# EAGLE design Ponte_h - Alternativa 2 (EAGLE 6.6.0)
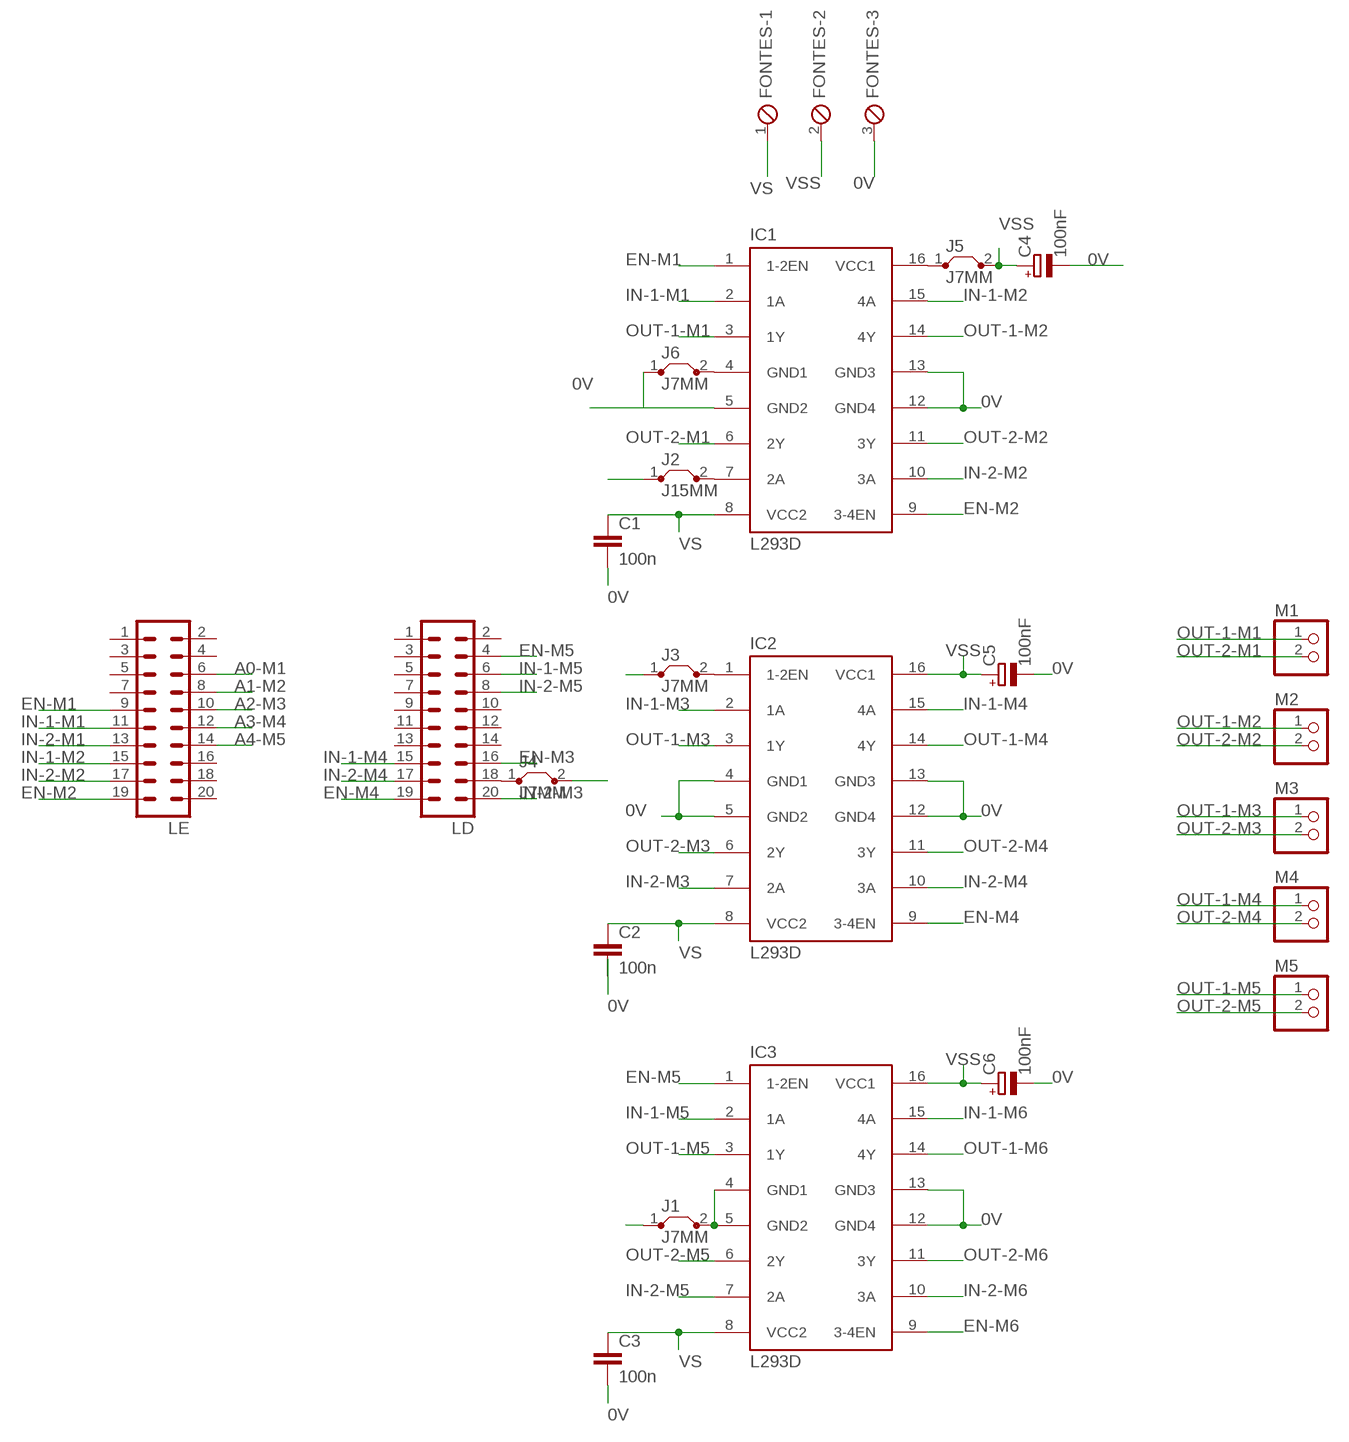
[diagram p0: schematic, sheet 1]

## Parts
C1  100n  C7.5/3  [C7.5B3]
C2  100n  C7.5/3  [C7.5B3]
C3  100n  C7.5/3  [C7.5B3]
C4  100nF  CPOL-EUE1.8-4  [E1,8-4]
C5  100nF  CPOL-EUE1.8-4  [E1,8-4]
C6  100nF  CPOL-EUE1.8-4  [E1,8-4]
FONTES  MPT3  [3POL254]
IC1  L293D  [DIL16]
IC2  L293D  [DIL16]
IC3  L293D  [DIL16]
J1  J7MM  [07]
J2  J15MM  [15]
J3  J7MM  [07]
J4  J7MM  [07]
J5  J7MM  [07]
J6  J7MM  [07]
LD  MA10-2  [MA10-2]
LE  MA10-2  [MA10-2]
M1  PINHD-1X2  [1X02]
M2  PINHD-1X2  [1X02]
M3  PINHD-1X2  [1X02]
M4  PINHD-1X2  [1X02]
M5  PINHD-1X2  [1X02]

## Nets
0V: C1.2 C2.2 C3.2 C4.- C5.- C6.- FONTES.3 IC1.5(GND2) IC1.12(GND4) IC1.13(GND3) IC2.4(GND1) IC2.5(GND2) IC2.12(GND4) IC2.13(GND3) IC3.12(GND4) IC3.13(GND3) J1.1 J6.1
A0-M1: LE.6
A1-M2: LE.8
A2-M3: LE.10
A3-M4: LE.12
A4-M5: LE.14
EN-M1: IC1.1(1-2EN) LE.9
EN-M2: IC1.9(3-4EN) LE.19
EN-M3: J3.1 J4.2 LD.16
EN-M4: IC2.9(3-4EN) LD.19
EN-M5: IC3.1(1-2EN) LD.4
EN-M6: IC3.9(3-4EN)
IN-1-M1: IC1.2(1A) LE.11
IN-1-M2: IC1.15(4A) LE.15
IN-1-M3: IC2.2(1A)
IN-1-M4: IC2.15(4A) LD.15
IN-1-M5: IC3.2(1A) LD.6
IN-1-M6: IC3.15(4A)
IN-2-M1: J2.1 LE.13
IN-2-M2: IC1.10(3A) LE.17
IN-2-M3: IC2.7(2A) LD.20
IN-2-M4: IC2.10(3A) LD.17
IN-2-M5: IC3.7(2A) LD.8
IN-2-M6: IC3.10(3A)
N$1: IC1.7(2A) J2.2
N$2: IC3.4(GND1) IC3.5(GND2) J1.2
N$3: IC2.1(1-2EN) J3.2
N$4: J4.1 LD.18
N$5: IC1.16(VCC1) J5.1
N$6: IC1.4(GND1) J6.2
OUT-1-M1: IC1.3(1Y) M1.1
OUT-1-M2: IC1.14(4Y) M2.1
OUT-1-M3: IC2.3(1Y) M3.1
OUT-1-M4: IC2.14(4Y) M4.1
OUT-1-M5: IC3.3(1Y) M5.1
OUT-1-M6: IC3.14(4Y)
OUT-2-M1: IC1.6(2Y) M1.2
OUT-2-M2: IC1.11(3Y) M2.2
OUT-2-M3: IC2.6(2Y) M3.2
OUT-2-M4: IC2.11(3Y) M4.2
OUT-2-M5: IC3.6(2Y) M5.2
OUT-2-M6: IC3.11(3Y)
VS: C1.1 C2.1 C3.1 FONTES.1 IC1.8(VCC2) IC2.8(VCC2) IC3.8(VCC2)
VSS: C4.+ C5.+ C6.+ FONTES.2 IC2.16(VCC1) IC3.16(VCC1) J5.2
Unconnected: LD.1 LD.2 LD.3 LD.5 LD.7 LD.9 LD.10 LD.11 LD.12 LD.13 LD.14 LE.1 LE.2 LE.3 LE.4 LE.5 LE.7 LE.16 LE.18 LE.20

## Library data of the parts
C1-C3 = capacitor-wima:C: CAPACITOR naming: grid - package width
C4-C6 = rcl:CPOL-EU: POLARIZED CAPACITOR, European symbol
FONTES = con-phoenix-254:MPT3: PHOENIX CONNECTOR; OC_FARNELL: unknown; OC_NEWARK: unknown
IC1-IC3 = st-microelectronics:L293D: PUSH-PULL 4 CHANNEL DRIVER; MPN: L293D; OC_FARNELL: 9589619; OC_NEWARK: 56P8249
J1-J6 = jumper:J: Bridge
LD LE = con-lstb:MA10-2: PIN HEADER; OC_FARNELL: unknown; OC_NEWARK: unknown
M1-M5 = pinhead:PINHD-1X2: PIN HEADER

## Board
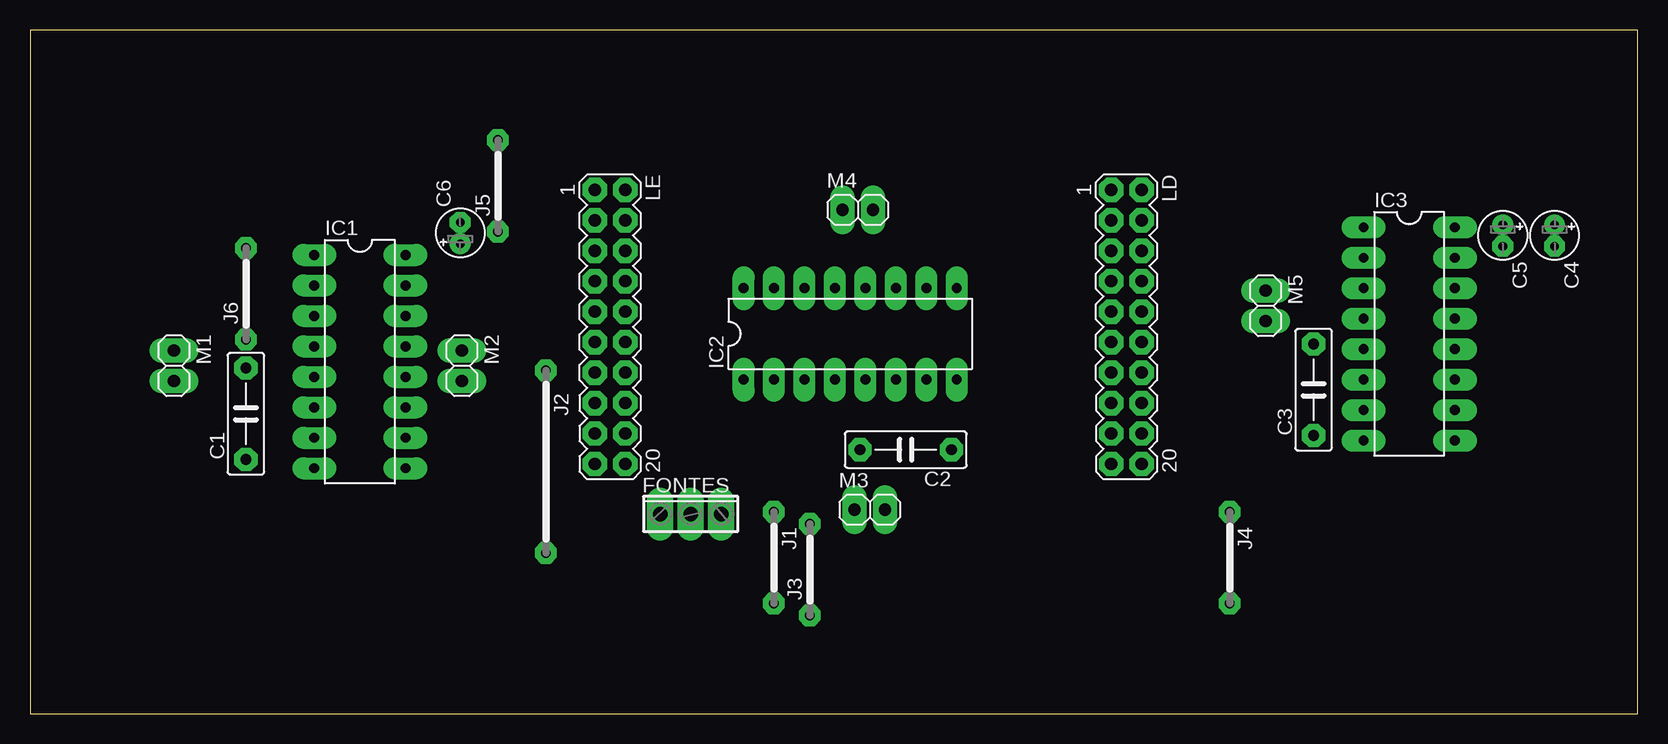
[diagram p1: board, top side]
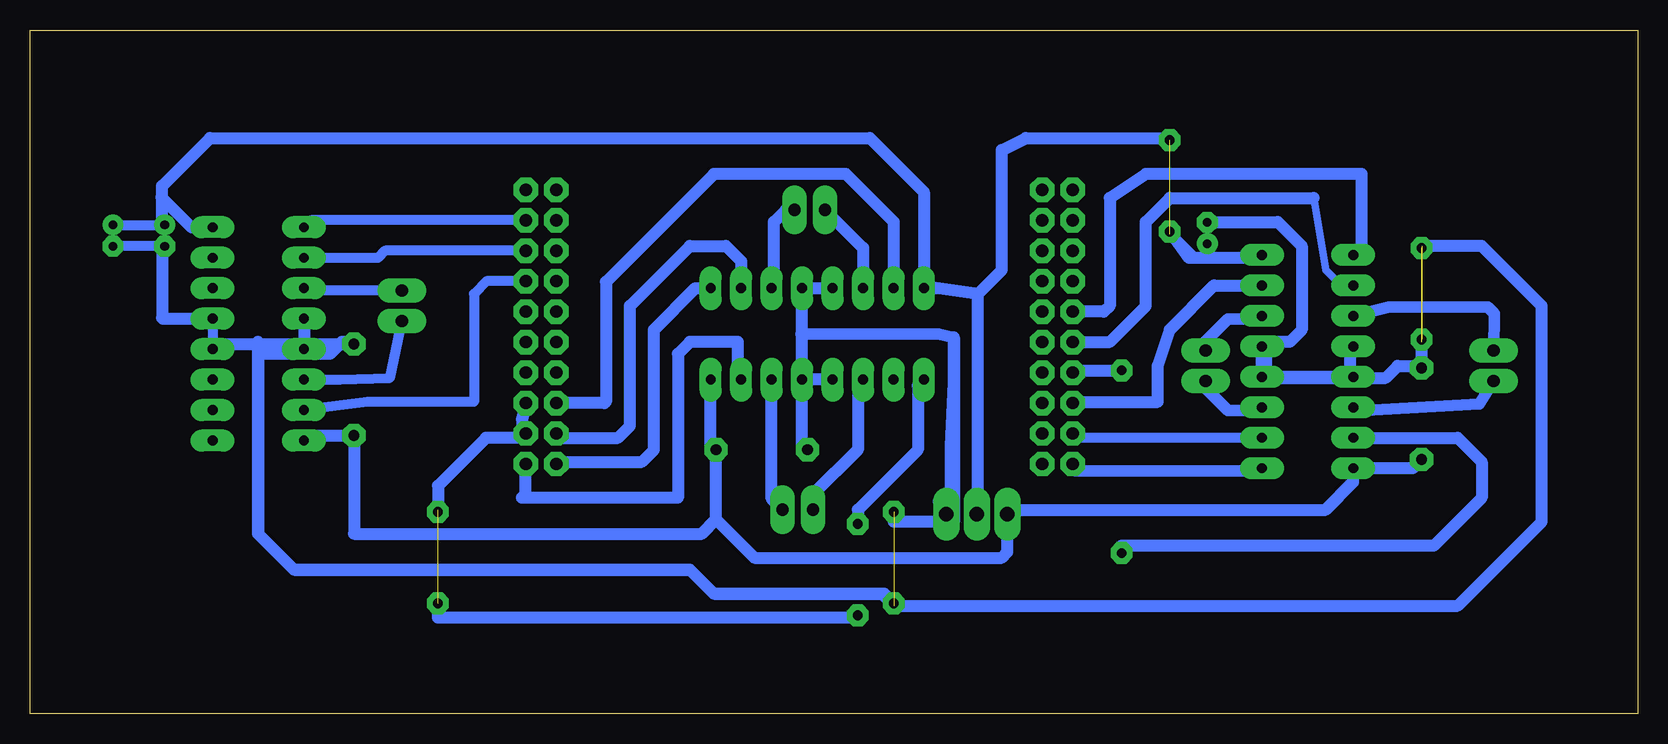
[diagram p2: board, bottom side, seen from below]

Size 134 x 57 mm. Coordinates in mm from the lower left corner, seen from the top.
Outline: 0,0 134,0 134,57 0,57 0,0
Copper layers (1*16): Top 0.035mm / dielectric 1.5mm / Bottom 0.035mm
Design rules "default *": minimum track width 37mil, minimum drill 24mil, track to track 24mil, track to pad 24mil, pad to pad 8mil, via to via 8mil, smd to smd 8mil, copper to edge 40mil, drill to drill 8mil, minimum pad ring 20mil, minimum via ring 8mil, stop-mask expansion 4mil, vias tented up to drill 0mil, thermal gap 10mil

### Footprints (pad centres in the part's own frame; a part is rotated, then mirrored left to right if it is on the bottom)
C7.5B3 = drill 0.914 pad 1.905 octagon: 1 -3.81,0; 2 3.81,0
E1,8-4 = drill 0.711 pad 1.168: + -0.889,0 | drill 0.711 pad 1.168 octagon: - 0.889,0
3POL254 = drill 1.2 long: 1 -2.54,0; 2 0,0; 3 2.54,0
DIL16 = drill 0.813 long: 1 -8.89,-3.81; 2 -6.35,-3.81; 3 -3.81,-3.81; 4 -1.27,-3.81; 5 1.27,-3.81; 6 3.81,-3.81; 7 6.35,-3.81; 8 8.89,-3.81; 9 8.89,3.81; 10 6.35,3.81; 11 3.81,3.81; 12 1.27,3.81; 13 -1.27,3.81; 14 -3.81,3.81; 15 -6.35,3.81; 16 -8.89,3.81
07 = drill 0.813 pad 1.6 octagon: 1 -3.81,0; 2 3.81,0
15 = drill 0.813 pad 1.6 octagon: 1 -7.62,0; 2 7.62,0
MA10-2 = drill 1.016 octagon: 1 -11.43,-1.27; 2 -11.43,1.27; 3 -8.89,-1.27; 4 -8.89,1.27; 5 -6.35,-1.27; 6 -6.35,1.27; 7 -3.81,-1.27; 8 -3.81,1.27; 9 -1.27,-1.27; 10 -1.27,1.27; 11 1.27,-1.27; 12 1.27,1.27; 13 3.81,-1.27; 14 3.81,1.27; 15 6.35,-1.27; 16 6.35,1.27; 17 8.89,-1.27; 18 8.89,1.27; 19 11.43,-1.27; 20 11.43,1.27
1X02 = drill 1.016 long: 1 -1.27,0; 2 1.27,0

### Placement (x,y rotation side)
C1  18,25 90 top
C2  73,22 180 top
C3  107,27 90 top
C4  127.09,39.86 270 top
C5  122.77,39.86 270 top
C6  35.86,40.07 90 top
FONTES  55.08,16.64 0 top
IC1  27.5,29.34 270 top
IC2  68.37,31.66 0 top
IC3  114.97,31.66 270 top
J1  62,13 270 top
J2  43,21 270 top
J3  65,12 90 top
J4  100,13 270 top
J5  39,44 90 top
J6  18,35 90 top
LD  91.4,32.24 270 top
LE  48.35,32.24 270 top
M1  12,29 270 top
M2  36,29 270 top
M3  70,17 0 top
M4  69,42 0 top
M5  103,34 270 top

### Tracks (layer width: path | path; a pad name or v marks a point on that pad's centre or on a via)
0V  (3 unrouted)
  Bottom 0.61: IC1.13 30.92,31 29,31 | 28,39 29,40 30.04,40.96 C6.-
  Bottom 0.813: IC3.13 IC3.12 | C5.- C4.-
  Bottom 0.94: 69.72,31.64 69.64,31.64 58.29,31.64 57.02,31.37 57.02,27.56 57.29,22.29 57.29,17 58.29,17.67 FONTES.3
  Bottom 1.016: 23.62,28 IC1.5 IC1.12 IC1.13 | 23.62,28 21,28 20,29 18,29 | IC2.4 IC2.5 | IC2.5 69.64,31.64 IC2.12 IC2.13 | C5.- 123,38.74 123,33 122.93,32.93 IC3.13 | C3.2 107,31 | J1.1 61.81,16 | 57,16 57.29,17 | 57.29,17 58,18 | C2.2 69.64,22.45 IC2.5 | IC3.12 118.36,30.81 C3.2 | C1.2 18,29 | C3.2 107.19,31 108,31 109,30 115,30 115,15 112,12 79,12 77,10 63,10 62,9 15,9 8,16 8,34 13,39 18,39 | 57.02,31.37 57,31.35 57,17 | 57,17 57.29,17 | 61.81,16 62,17 | C6.- 35.82,41 30,41 28,39 28,32 29,31 31,31 31,28 23.62,28 | 18,29 J6.1 | 57,17 57,16 | 57,16 61.81,16 | 61.81,16 62,16
EN-M1
  Bottom 1.016: IC1.1 23,38.92 23,45 41,45 44,43 44,34 44.49,33.51 LE.9
EN-M2
  Bottom 0.94: IC1.9 31.62,20.21 46.86,20.21 LE.19
EN-M3  (1 unrouted)
  Bottom 1.016: J3.1 65.19,8 100,8 J4.2 | LD.16 93,24.56 93,23 96,23 100,19 100,17
EN-M4
  Bottom 1.016: LD.19 89.94,21 83,21 82,22 82,32 78.53,35.47 IC2.9
EN-M5
  Bottom 0.813: LD.4 110.58,41.13 IC3.1
IN-1-M1
  Bottom 0.61: 27,43 26,37 24.69,35.69
  Bottom 1.016: LE.11 47.05,31 44,31 41,34 41,41 39,43 27,43 | 24.69,35.69 IC1.2
IN-1-M2
  Bottom 0.813: 31.62,36 IC1.15
  Bottom 1.016: LE.15 46.97,26 40,26 40,29 39,32 35.31,35.69 IC1.15
IN-1-M4
  Bottom 1.016: IC2.15 62,35.49 62,41 66,45 77,45 86,36 86,26 86.11,25.89 LD.15
IN-1-M5
  Bottom 0.813: LD.6 104.41,38.59 105,38 IC3.2
IN-2-M1
  Bottom 1.016: LE.13 46.89,28.62 J2.1
IN-2-M2
  Bottom 0.813: IC1.10 41.99,22.99 42,23 46.73,23 LE.17
IN-2-M3
  Bottom 1.016: IC2.7 75,28.13 75,31 79,31 80,30 80,18 93,18 92.67,18.33 LD.20
IN-2-M4
  Bottom 1.016: LD.17 89.78,23 85,23 84,24 84,34 79,39 76,39 74.72,37.72 IC2.10
IN-2-M5
  Bottom 0.813: LD.8 95.95,36.05 97,35 97,26 105.85,26 IC3.7
N$1
  Bottom 1.016: IC1.7 15,23 13,21 13,18 17,14 43,14 J2.2
N$2
  Bottom 1.016: IC3.4 IC3.5 114.39,30.39 115,31 115,15 112,12 79,12 77,10 62.81,10 J1.2
N$3
  Bottom 1.016: IC2.1 60,27.33 60,22 65,17 J3.2
N$4
  Bottom 1.016: LD.18 93.02,23 96,23 100,19 J4.1
N$5
  Bottom 1.016: J5.1 37.38,38 31.54,38 IC1.16
N$6  (1 unrouted)
  Bottom 1.016: IC1.4 24,30.3 24,28 21,28 20,29 18,29 18,31
OUT-1-M1
  Bottom 0.94: IC1.3 20.73,33.91 12.46,33.91 11.92,33.37 M1.1
OUT-1-M2
  Bottom 0.94: IC1.14 31.62,32.91 34.16,32.91 36.7,30.37 M2.1
OUT-1-M3
  Bottom 1.016: IC2.3 65,27.41 65,22 68.73,18.27 M3.1
OUT-1-M4
  Bottom 1.016: M4.1 64.56,38.83 IC2.14
OUT-1-M5
  Bottom 0.813: M5.1 110.96,35.27 IC3.3
OUT-2-M1
  Bottom 0.94: IC1.6 22.73,25.29 13.19,25.83 M1.2
OUT-2-M2
  Bottom 0.94: IC1.11 31.62,25.29 34.16,25.29 36.7,27.83 M2.2
OUT-2-M3
  Bottom 1.016: M3.2 72.18,17.91 IC2.6
OUT-2-M4
  Bottom 1.016: IC2.11 72,35.65 72,41 71,42 M4.2
OUT-2-M5
  Bottom 0.813: IC3.6 108.15,27.85 104,28 M5.2
VS
  Bottom 1.016: C1.1 18.74,20.45 IC1.8 23.69,19.31 26,17 52.18,17 FONTES.1 52.54,13.46 53,13 73.62,13 76.81,16.19 | IC2.8 77.26,22.45 C2.1 76.81,16.19 | IC3.8 110.74,23.19 C3.1 107,15 78,15 76.81,16.19
VSS  (1 unrouted)
  Bottom 0.813: C4.+ C5.+
  Bottom 0.94: IC3.16 119.25,40.53 120.52,40.53 123.06,43.07 123,43.07 | J5.2 39.24,48.15 39.24,48
  Bottom 1.016: C6.+ 36,38.04 36,38 | C5.+ 123,40.98 123,43.07 123,44 119,48 64,48 59.48,43.48 IC2.16 58.47,35.47 55,35 | FONTES.2 55,16.72 55,35 | 55,35 53,37 53,47 51,48 39.24,48 39,48 | 31.26,38.18 31.44,38 36,38 | 36,38 37,38 39,40